# Altium schematic sheet 00_Top_Level_Sheet.SchDoc
size A3
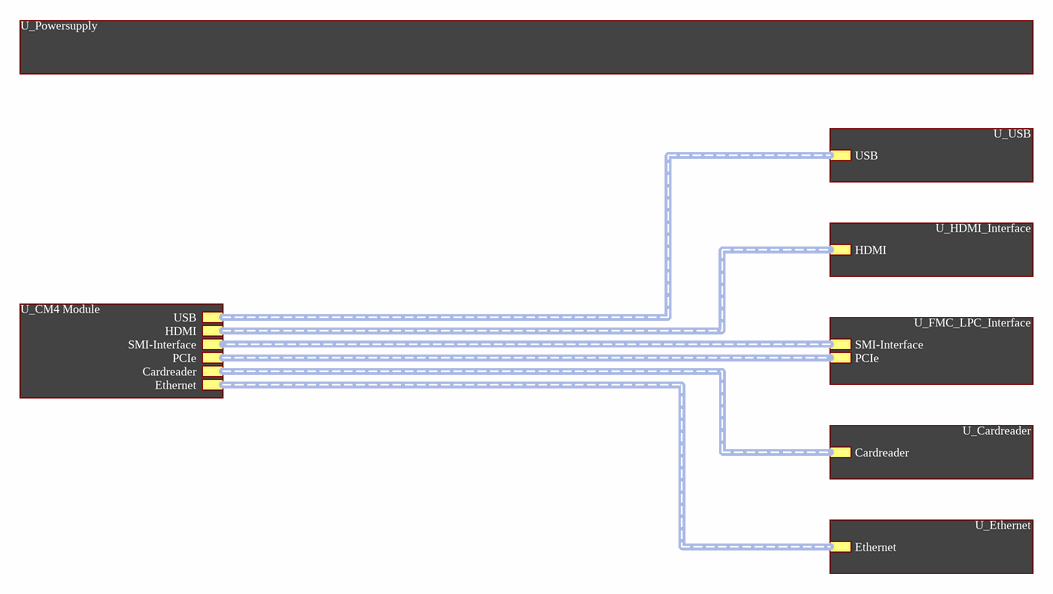
[diagram p0: 00_Top_Level_Sheet.SchDoc]

## Sub-sheets
U_Cardreader = 05_Cardreader.SchDoc: Cardreader (harness Cardreader)
U_CM4 Module = 02_CM4 Module.SchDoc: Ethernet (harness Ethernet), Cardreader (harness Cardreader), SMI-Interface (harness SMI-Interface), HDMI (harness HDMI), USB (harness USB-A), PCIe (harness PCIe)
U_Ethernet = 06_Ethernet.SchDoc: Ethernet (harness Ethernet)
U_FMC_LPC_Interface = 07_FMC_LPC_Interface.SchDoc: SMI-Interface (harness SMI-Interface), PCIe (harness PCIe)
U_HDMI_Interface = 04_HDMI_Interface.SchDoc: HDMI (harness HDMI)
U_Powersupply = 01_Powersupply.SchDoc: no entries
U_USB = 03_USB.SchDoc: USB (harness USB-A)

## Buses and harness runs
harness sheet U_Cardreader/Cardreader = sheet U_CM4 Module/Cardreader
harness sheet U_CM4 Module/Ethernet = sheet U_Ethernet/Ethernet
harness sheet U_CM4 Module/HDMI = sheet U_HDMI_Interface/HDMI
harness sheet U_CM4 Module/PCIe = sheet U_FMC_LPC_Interface/PCIe
harness sheet U_CM4 Module/SMI-Interface = sheet U_FMC_LPC_Interface/SMI-Interface
harness sheet U_CM4 Module/USB = sheet U_USB/USB

## Notes on the sheet
- Title:
- ++CONFIDENTIAL++
- Date:
- Sheet:
- /
- Time:
- Engineer
- Elektronik- und Softwareentwicklung aus Nürnberg
- The  information  contained  in  these  documents  is  confidential,  privileged  and  only  for  the
  information of the intended recipient and may
  not be used, published or redistributed without
  the prior written consent from PCB Arts GmbH.
- Revision:
- Checked:
- https://pcb-arts.com/
- mail@pcb-arts.com